# EAGLE design stm32wb55vgy6-breakout (EAGLE 9.6.2)
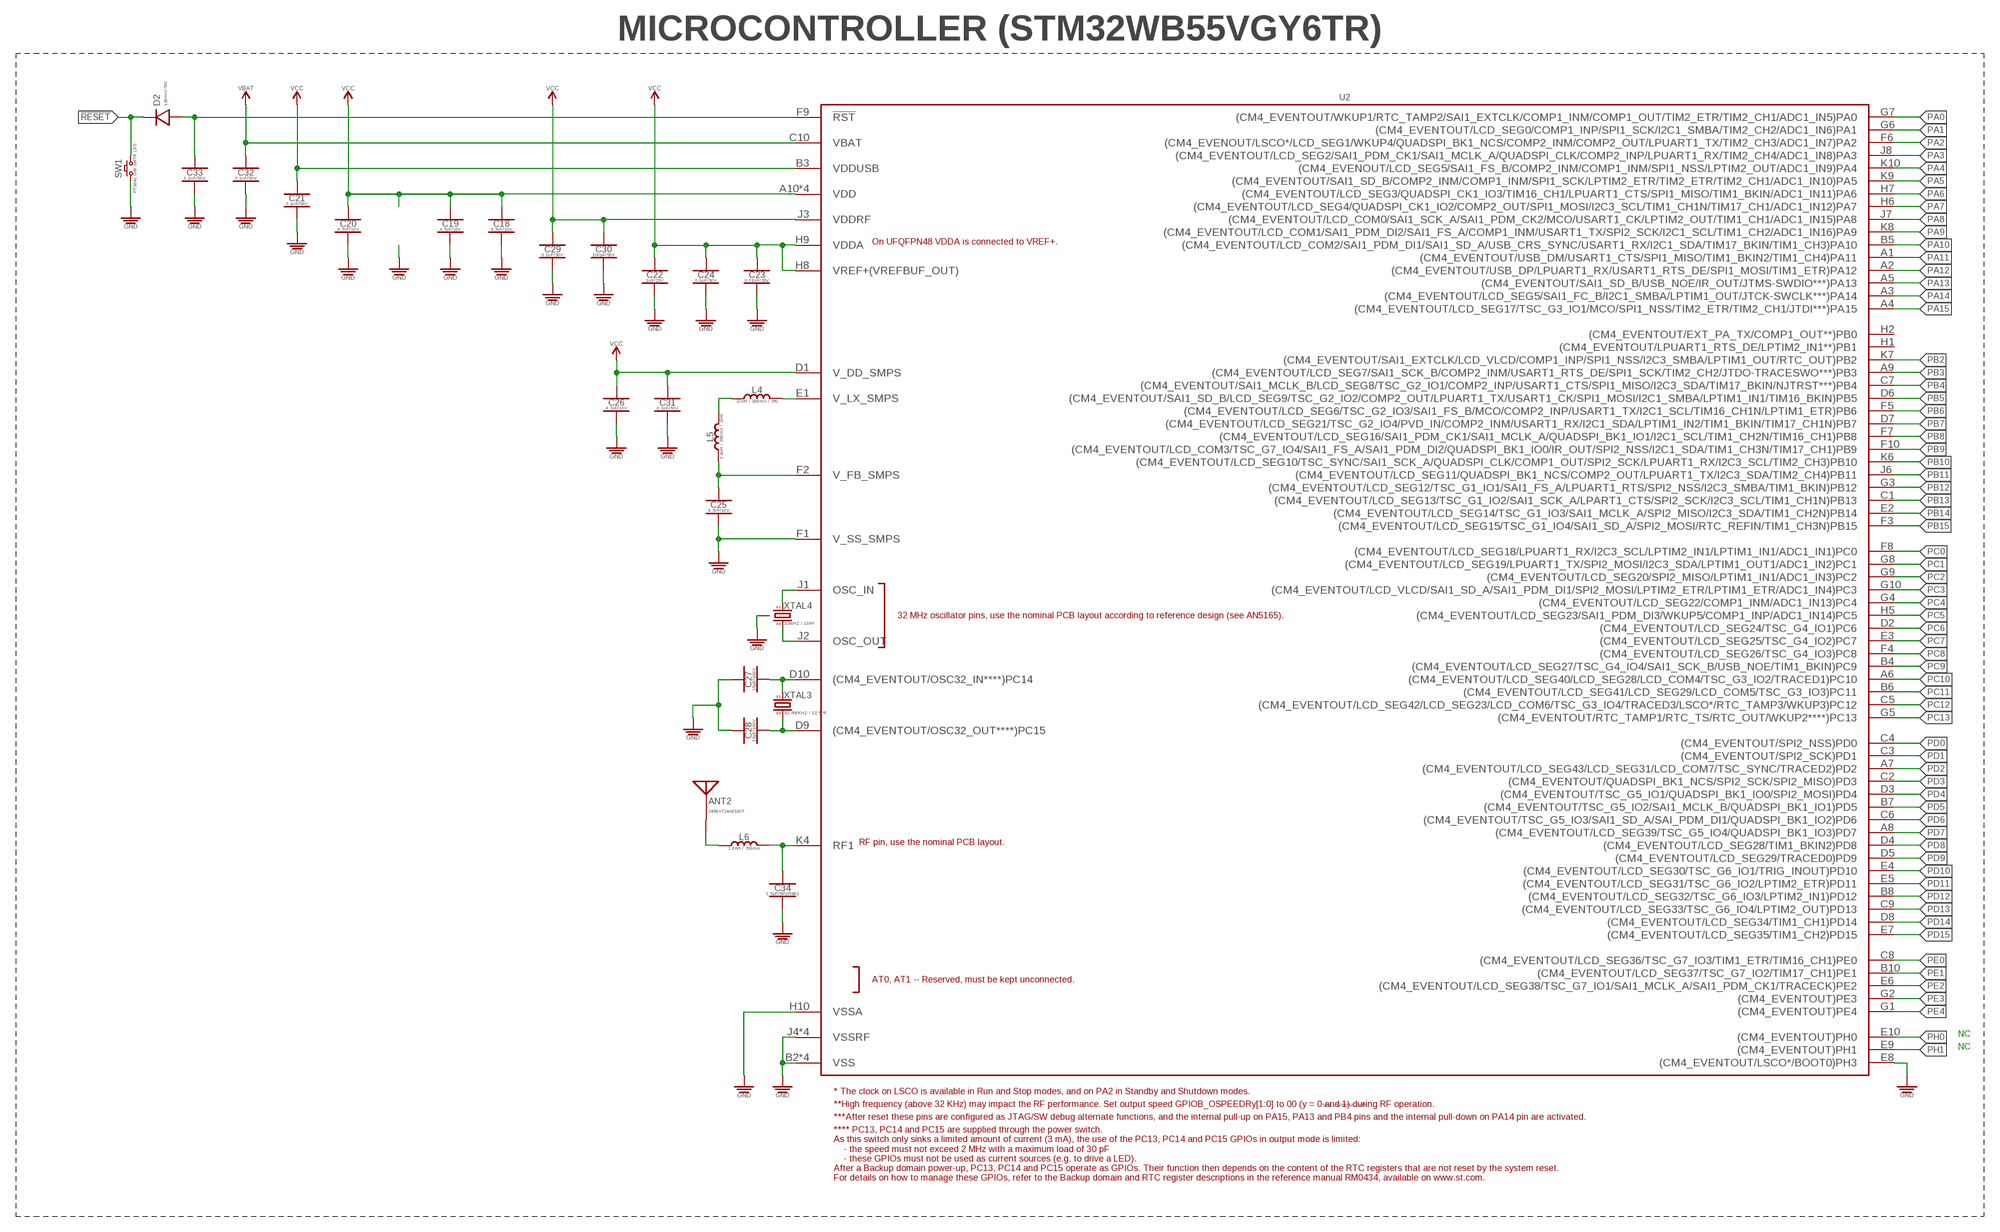
[diagram p0: schematic, sheet 1, part 1 of 2]
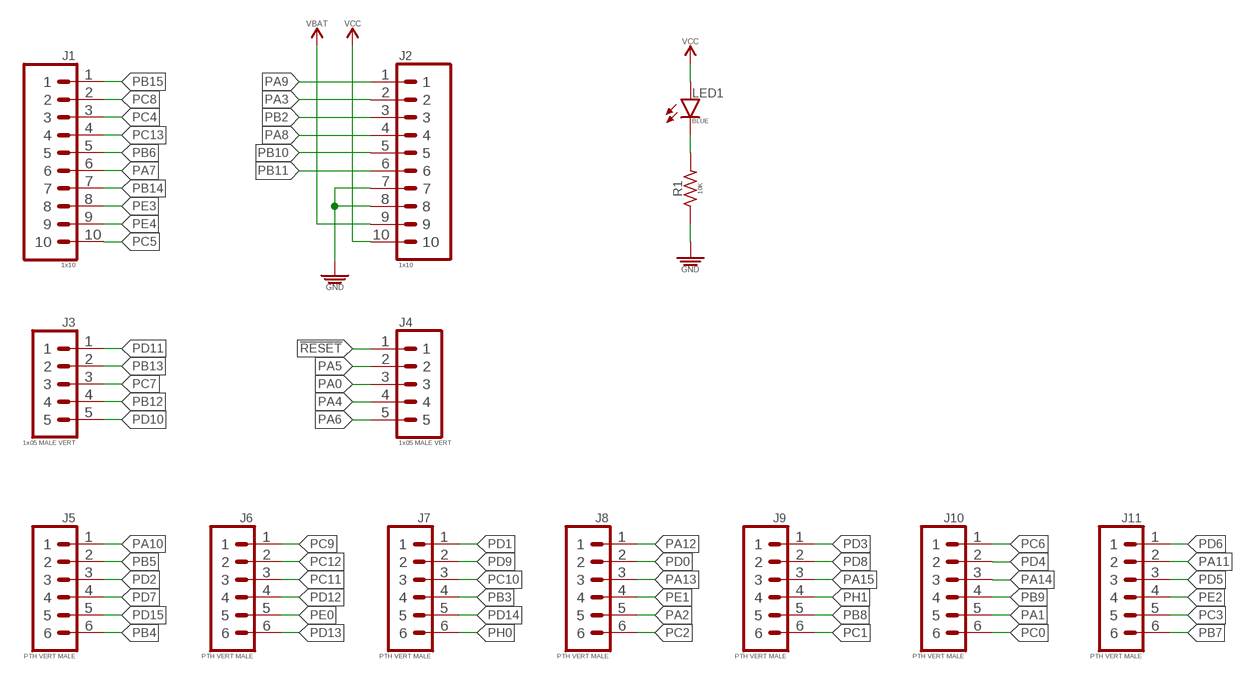
[diagram p1: schematic, sheet 1, part 2 of 2]

## Parts
ANT2  2450AT14A0100T  2.4GHZ-1PIN  [RESC1608X40N]
C18  4.7uF/10V  4.7UF_CER_SMD-0402_10V-20%  [CAPC1005X55_SMD-0402]
C19  4.7uF/10V  4.7UF_CER_SMD-0402_10V-20%  [CAPC1005X55_SMD-0402]
C20  4.7uF/10V  4.7UF_CER_SMD-0402_10V-20%  [CAPC1005X55_SMD-0402]
C21  0.1uF/50V  0.1UF_SMD-0402_50V-10%  [CAPC1005X55_SMD-0402]
C22  1uF/25V  1UF_CER_SMD-0402_25V-10%  [CAPC1005X55_SMD-0402]
C23  0.01uF/35V  0.01UF_CER_SMD-0402_35V-10%  [CAPC1005X55_SMD-0402]
C24  0.1uF/50V  0.1UF_SMD-0402_50V-10%  [CAPC1005X55_SMD-0402]
C25  4.7uF/10V  4.7UF_CER_SMD-0402_10V-20%  [CAPC1005X55_SMD-0402]
C26  4.7uF/10V  4.7UF_CER_SMD-0402_10V-20%  [CAPC1005X55_SMD-0402]
C27  15pF/100V  15PF_SMD-0402_100V-10%  [CAPC1005X55_SMD-0402]
C28  15pF/100V  15PF_SMD-0402_100V-10%  [CAPC1005X55_SMD-0402]
C29  0.1uF/50V  0.1UF_SMD-0402_50V-10%  [CAPC1005X55_SMD-0402]
C30  100pF/50V  100PF_SMD-0402_50V-10%  [CAPC1005X55_SMD-0402]
C31  0.1uF/50V  0.1UF_SMD-0402_50V-10%  [CAPC1005X55_SMD-0402]
C32  0.1uF/50V  0.1UF_SMD-0402_50V-10%  [CAPC1005X55_SMD-0402]
C33  0.1uF/50V  0.1UF_SMD-0402_50V-10%  [CAPC1005X55_SMD-0402]
C34  1.5pF/50V/0402  1.5PF_CER_SMD-0402-100V-5%  [CAPC1005X55_SMD-0402]
D2  150mA/75V  GENERAL-PURPOSE_SMD-0402_GP_150MA-75V  [DFN100X60X55-2]
J1  1x10  1X10_PTH_VERT-MALE_2.54MM  [HDRV10W64P254_1X10_2540X254X838B]
J2  1x10  1X10_PTH_VERT-MALE_2.54MM  [HDRV10W64P254_1X10_2540X254X838B]
J3  1x05 MALE VERT  1X05_PTH_VERT_MALE_2.54MM  [HDRV5W64P254_1X5_1270X254X838B]
J4  1x05 MALE VERT  1X05_PTH_VERT_MALE_2.54MM  [HDRV5W64P254_1X5_1270X254X838B]
J5  PTH VERT MALE  1X06_PTH_VERT_MALE_2.54MM  [HDRV6W64P254_1X6_1524X254X838B]
J6  PTH VERT MALE  1X06_PTH_VERT_MALE_2.54MM  [HDRV6W64P254_1X6_1524X254X838B]
J7  PTH VERT MALE  1X06_PTH_VERT_MALE_2.54MM  [HDRV6W64P254_1X6_1524X254X838B]
J8  PTH VERT MALE  1X06_PTH_VERT_MALE_2.54MM  [HDRV6W64P254_1X6_1524X254X838B]
J9  PTH VERT MALE  1X06_PTH_VERT_MALE_2.54MM  [HDRV6W64P254_1X6_1524X254X838B]
J10  PTH VERT MALE  1X06_PTH_VERT_MALE_2.54MM  [HDRV6W64P254_1X6_1524X254X838B]
J11  PTH VERT MALE  1X06_PTH_VERT_MALE_2.54MM  [HDRV6W64P254_1X6_1524X254X838B]
L4  10nH / 200mA / 2%  10NH_SMD-0402_200MA-1.35OHM-2%  [INDC1005X32N]
L5  2.2uH / 350mA / 20%  2.2UH_SMD-0402_350MA-0.550OHM-20%  [INDC1005X32N]
L6  1.8nH / 700mA  1.8NH_SMD-0402_200MA-1.35OHM-2%  [INDC1005X32N]
LED1  BLUE  LED_SMD-0402_DISCRETE_BLUE  [LEDC1005X40_LED-0402]
R1  10K  10KΩ_SMD-0402_1/16W-5%  [RESC1005X35_SMD-0402]
SW1  PTS841 GM SMTR LFS  SWITCH_MOMENTARY_PTS841GMSMTRLFS  [SW_MOMENTARY_SPST-NO_PTS841-GM-SMTR-LFS]
U2  STM32WB55VGY6TR  STM32WB55VXYX-STM32WB55VGY6  [BGA100N40P10X10_438X440X59N]
XTAL3  32.768KHZ / 12.5PF  CRYSTAL-2_NX2012SA_23K768_12.5PF  [OSCCC205X120X55N]
XTAL4  32MHZ / 10PF  CRYSTAL-4_ABM11_32MHZ_10PF  [OSCCC200X160X59N]

## Nets
!RESET!: D2.K J4.1 SW1.3 SW1.4
FEED: ANT2.FEED L6.1
GND: C18.2 C19.2 C20.2 C21.2 C22.2 C23.2 C24.2 C25.2 C26.2 C27.1 C28.1 C29.2 C30.2 C31.2 C32.2 C33.2 C34.2 J2.7 J2.8 R1.1 SW1.1 SW1.2 U2.B2(VSS) U2.B9(VSS) U2.E8((CM4_EVENTOUT/LSCO*/BOOT0)PH3) U2.F1(V_SS_SMPS) U2.H10(VSSA) U2.J4(VSSRF) U2.J5(VSS) U2.J9(VSS) U2.K1(VSSRF) U2.K2(VSSRF) U2.K3(VSSRF) XTAL4.2(GND) XTAL4.4(GND)
N$1: LED1.K R1.2
N$10: L4.1 L5.2
N$11: C25.1 L5.1 U2.F2(V_FB_SMPS)
N$12: U2.J1(OSC_IN) XTAL4.1(XTAL1)
N$13: U2.J2(OSC_OUT) XTAL4.3(XTAL2)
N$14: C27.2 U2.D10((CM4_EVENTOUT/OSC32_IN****)PC14) XTAL3.X1
N$15: C28.2 U2.D9((CM4_EVENTOUT/OSC32_OUT****)PC15) XTAL3.X2
N$16: L4.2 U2.E1(V_LX_SMPS)
N$18: C33.1 D2.A U2.F9(!RST!)
PA0: J4.3 U2.G7((CM4_EVENTOUT/WKUP1/RTC_TAMP2/SAI1_EXTCLK/COMP1_INM/COMP1_OUT/TIM2_ETR/TIM2_CH1/ADC1_IN5)PA0)
PA1: J10.5 U2.G6((CM4_EVENTOUT/LCD_SEG0/COMP1_INP/SPI1_SCK/I2C1_SMBA/TIM2_CH2/ADC1_IN6)PA1)
PA2: J8.5 U2.F6((CM4_EVENOUT/LSCO*/LCD_SEG1/WKUP4/QUADSPI_BK1_NCS/COMP2_INM/COMP2_OUT/LPUART1_TX/TIM2_CH3/ADC1_IN7)PA2)
PA3: J2.2 U2.J8((CM4_EVENTOUT/LCD_SEG2/SAI1_PDM_CK1/SAI1_MCLK_A/QUADSPI_CLK/COMP2_INP/LPUART1_RX/TIM2_CH4/ADC1_IN8)PA3)
PA4: J4.4 U2.K10((CM4_EVENOUT/LCD_SEG5/SAI1_FS_B/COMP2_INM/COMP1_INM/SPI1_NSS/LPTIM2_OUT/ADC1_IN9)PA4)
PA5: J4.2 U2.K9((CM4_EVENTOUT/SAI1_SD_B/COMP2_INM/COMP1_INM/SPI1_SCK/LPTIM2_ETR/TIM2_ETR/TIM2_CH1/ADC1_IN10)PA5)
PA6: J4.5 U2.H7((CM4_EVENTOUT/LCD_SEG3/QUADSPI_CK1_IO3/TIM16_CH1/LPUART1_CTS/SPI1_MISO/TIM1_BKIN/ADC1_IN11)PA6)
PA7: J1.6 U2.H6((CM4_EVENTOUT/LCD_SEG4/QUADSPI_CK1_IO2/COMP2_OUT/SPI1_MOSI/I2C3_SCL/TIM1_CH1N/TIM17_CH1/ADC1_IN12)PA7)
PA8: J2.4 U2.J7((CM4_EVENTOUT/LCD_COM0/SAI1_SCK_A/SAI1_PDM_CK2/MCO/USART1_CK/LPTIM2_OUT/TIM1_CH1/ADC1_IN15)PA8)
PA9: J2.1 U2.K8((CM4_EVENTOUT/LCD_COM1/SAI1_PDM_DI2/SAI1_FS_A/COMP1_INM/USART1_TX/SPI2_SCK/I2C1_SCL/TIM1_CH2/ADC1_IN16)PA9)
PA10: J5.1 U2.B5((CM4_EVENTOUT/LCD_COM2/SAI1_PDM_DI1/SAI1_SD_A/USB_CRS_SYNC/USART1_RX/I2C1_SDA/TIM17_BKIN/TIM1_CH3)PA10)
PA11: J11.2 U2.A1((CM4_EVENTOUT/USB_DM/USART1_CTS/SPI1_MISO/TIM1_BKIN2/TIM1_CH4)PA11)
PA12: J8.1 U2.A2((CM4_EVENTOUT/USB_DP/LPUART1_RX/USART1_RTS_DE/SPI1_MOSI/TIM1_ETR)PA12)
PA13: J8.3 U2.A5((CM4_EVENTOUT/SAI1_SD_B/USB_NOE/IR_OUT/JTMS-SWDIO***)PA13)
PA14: J10.3 U2.A3((CM4_EVENTOUT/LCD_SEG5/SAI1_FC_B/I2C1_SMBA/LPTIM1_OUT/JTCK-SWCLK***)PA14)
PA15: J9.3 U2.A4((CM4_EVENTOUT/LCD_SEG17/TSC_G3_IO1/MCO/SPI1_NSS/TIM2_ETR/TIM2_CH1/JTDI***)PA15)
PB2: J2.3 U2.K7((CM4_EVENTOUT/SAI1_EXTCLK/LCD_VLCD/COMP1_INP/SPI1_NSS/I2C3_SMBA/LPTIM1_OUT/RTC_OUT)PB2)
PB3: J7.4 U2.A9((CM4_EVENTOUT/LCD_SEG7/SAI1_SCK_B/COMP2_INM/USART1_RTS_DE/SPI1_SCK/TIM2_CH2/JTDO-TRACESWO***)PB3)
PB4: J5.6 U2.C7((CM4_EVENTOUT/SAI1_MCLK_B/LCD_SEG8/TSC_G2_IO1/COMP2_INP/USART1_CTS/SPI1_MISO/I2C3_SDA/TIM17_BKIN/NJTRST***)PB4)
PB5: J5.2 U2.D6((CM4_EVENTOUT/SAI1_SD_B/LCD_SEG9/TSC_G2_IO2/COMP2_OUT/LPUART1_TX/USART1_CK/SPI1_MOSI/I2C1_SMBA/LPTIM1_IN1/TIM16_BKIN)PB5)
PB6: J1.5 U2.F5((CM4_EVENTOUT/LCD_SEG6/TSC_G2_IO3/SAI1_FS_B/MCO/COMP2_INP/USART1_TX/I2C1_SCL/TIM16_CH1N/LPTIM1_ETR)PB6)
PB7: J11.6 U2.D7((CM4_EVENTOUT/LCD_SEG21/TSC_G2_IO4/PVD_IN/COMP2_INM/USART1_RX/I2C1_SDA/LPTIM1_IN2/TIM1_BKIN/TIM17_CH1N)PB7)
PB8: J9.5 U2.F7((CM4_EVENTOUT/LCD_SEG16/SAI1_PDM_CK1/SAI1_MCLK_A/QUADSPI_BK1_IO1/I2C1_SCL/TIM1_CH2N/TIM16_CH1)PB8)
PB9: J10.4 U2.F10((CM4_EVENTOUT/LCD_COM3/TSC_G7_IO4/SAI1_FS_A/SAI1_PDM_DI2/QUADSPI_BK1_IO0/IR_OUT/SPI2_NSS/I2C1_SDA/TIM1_CH3N/TIM17_CH1)PB9)
PB10: J2.5 U2.K6((CM4_EVENTOUT/LCD_SEG10/TSC_SYNC/SAI1_SCK_A/QUADSPI_CLK/COMP1_OUT/SPI2_SCK/LPUART1_RX/I2C3_SCL/TIM2_CH3)PB10)
PB11: J2.6 U2.J6((CM4_EVENTOUT/LCD_SEG11/QUADSPI_BK1_NCS/COMP2_OUT/LPUART1_TX/I2C3_SDA/TIM2_CH4)PB11)
PB12: J3.4 U2.G3((CM4_EVENTOUT/LCD_SEG12/TSC_G1_IO1/SAI1_FS_A/LPUART1_RTS/SPI2_NSS/I2C3_SMBA/TIM1_BKIN)PB12)
PB13: J3.2 U2.C1((CM4_EVENTOUT/LCD_SEG13/TSC_G1_IO2/SAI1_SCK_A/LPART1_CTS/SPI2_SCK/I2C3_SCL/TIM1_CH1N)PB13)
PB14: J1.7 U2.E2((CM4_EVENTOUT/LCD_SEG14/TSC_G1_IO3/SAI1_MCLK_A/SPI2_MISO/I2C3_SDA/TIM1_CH2N)PB14)
PB15: J1.1 U2.F3((CM4_EVENTOUT/LCD_SEG15/TSC_G1_IO4/SAI1_SD_A/SPI2_MOSI/RTC_REFIN/TIM1_CH3N)PB15)
PC0: J10.6 U2.F8((CM4_EVENTOUT/LCD_SEG18/LPUART1_RX/I2C3_SCL/LPTIM2_IN1/LPTIM1_IN1/ADC1_IN1)PC0)
PC1: J9.6 U2.G8((CM4_EVENTOUT/LCD_SEG19/LPUART1_TX/SPI2_MOSI/I2C3_SDA/LPTIM1_OUT1/ADC1_IN2)PC1)
PC2: J8.6 U2.G9((CM4_EVENTOUT/LCD_SEG20/SPI2_MISO/LPTIM1_IN1/ADC1_IN3)PC2)
PC3: J11.5 U2.G10((CM4_EVENTOUT/LCD_VLCD/SAI1_SD_A/SAI1_PDM_DI1/SPI2_MOSI/LPTIM2_ETR/LPTIM1_ETR/ADC1_IN4)PC3)
PC4: J1.3 U2.G4((CM4_EVENTOUT/LCD_SEG22/COMP1_INM/ADC1_IN13)PC4)
PC5: J1.10 U2.H5((CM4_EVENTOUT/LCD_SEG23/SAI1_PDM_DI3/WKUP5/COMP1_INP/ADC1_IN14)PC5)
PC6: J10.1 U2.D2((CM4_EVENTOUT/LCD_SEG24/TSC_G4_IO1)PC6)
PC7: J3.3 U2.E3((CM4_EVENTOUT/LCD_SEG25/TSC_G4_IO2)PC7)
PC8: J1.2 U2.F4((CM4_EVENTOUT/LCD_SEG26/TSC_G4_IO3)PC8)
PC9: J6.1 U2.B4((CM4_EVENTOUT/LCD_SEG27/TSC_G4_IO4/SAI1_SCK_B/USB_NOE/TIM1_BKIN)PC9)
PC10: J7.3 U2.A6((CM4_EVENTOUT/LCD_SEG40/LCD_SEG28/LCD_COM4/TSC_G3_IO2/TRACED1)PC10)
PC11: J6.3 U2.B6((CM4_EVENTOUT/LCD_SEG41/LCD_SEG29/LCD_COM5/TSC_G3_IO3)PC11)
PC12: J6.2 U2.C5((CM4_EVENTOUT/LCD_SEG42/LCD_SEG23/LCD_COM6/TSC_G3_IO4/TRACED3/LSCO*/RTC_TAMP3/WKUP3)PC12)
PC13: J1.4 U2.G5((CM4_EVENTOUT/RTC_TAMP1/RTC_TS/RTC_OUT/WKUP2****)PC13)
PD0: J8.2 U2.C4((CM4_EVENTOUT/SPI2_NSS)PD0)
PD1: J7.1 U2.C3((CM4_EVENTOUT/SPI2_SCK)PD1)
PD2: J5.3 U2.A7((CM4_EVENTOUT/LCD_SEG43/LCD_SEG31/LCD_COM7/TSC_SYNC/TRACED2)PD2)
PD3: J9.1 U2.C2((CM4_EVENTOUT/QUADSPI_BK1_NCS/SPI2_SCK/SPI2_MISO)PD3)
PD4: J10.2 U2.D3((CM4_EVENTOUT/TSC_G5_IO1/QUADSPI_BK1_IO0/SPI2_MOSI)PD4)
PD5: J11.3 U2.B7((CM4_EVENTOUT/TSC_G5_IO2/SAI1_MCLK_B/QUADSPI_BK1_IO1)PD5)
PD6: J11.1 U2.C6((CM4_EVENTOUT/TSC_G5_IO3/SAI1_SD_A/SAI_PDM_DI1/QUADSPI_BK1_IO2)PD6)
PD7: J5.4 U2.A8((CM4_EVENTOUT/LCD_SEG39/TSC_G5_IO4/QUADSPI_BK1_IO3)PD7)
PD8: J9.2 U2.D4((CM4_EVENTOUT/LCD_SEG28/TIM1_BKIN2)PD8)
PD9: J7.2 U2.D5((CM4_EVENTOUT/LCD_SEG29/TRACED0)PD9)
PD10: J3.5 U2.E4((CM4_EVENTOUT/LCD_SEG30/TSC_G6_IO1/TRIG_INOUT)PD10)
PD11: J3.1 U2.E5((CM4_EVENTOUT/LCD_SEG31/TSC_G6_IO2/LPTIM2_ETR)PD11)
PD12: J6.4 U2.B8((CM4_EVENTOUT/LCD_SEG32/TSC_G6_IO3/LPTIM2_IN1)PD12)
PD13: J6.6 U2.C9((CM4_EVENTOUT/LCD_SEG33/TSC_G6_IO4/LPTIM2_OUT)PD13)
PD14: J7.5 U2.D8((CM4_EVENTOUT/LCD_SEG34/TIM1_CH1)PD14)
PD15: J5.5 U2.E7((CM4_EVENTOUT/LCD_SEG35/TIM1_CH2)PD15)
PE0: J6.5 U2.C8((CM4_EVENTOUT/LCD_SEG36/TSC_G7_IO3/TIM1_ETR/TIM16_CH1)PE0)
PE1: J8.4 U2.B10((CM4_EVENTOUT/LCD_SEG37/TSC_G7_IO2/TIM17_CH1)PE1)
PE2: J11.4 U2.E6((CM4_EVENTOUT/LCD_SEG38/TSC_G7_IO1/SAI1_MCLK_A/SAI1_PDM_CK1/TRACECK)PE2)
PE3: J1.8 U2.G2((CM4_EVENTOUT)PE3)
PE4: J1.9 U2.G1((CM4_EVENTOUT)PE4)
PH0: J7.6 U2.E10((CM4_EVENTOUT)PH0)
PH1: J9.4 U2.E9((CM4_EVENTOUT)PH1)
RF: C34.1 L6.2 U2.K4(RF1)
VBAT: C32.1 J2.9 U2.C10(VBAT)
VCC: C18.1 C19.1 C20.1 C21.1 C22.1 C23.1 C24.1 C26.1 C29.1 C30.1 C31.1 J2.10 LED1.A U2.A10(VDD) U2.B1(VDD) U2.B3(VDDUSB) U2.D1(V_DD_SMPS) U2.H8(VREF+(VREFBUF_OUT)) U2.H9(VDDA) U2.J3(VDDRF) U2.J10(VDD) U2.K5(VDD)
Unconnected: U2.H1((CM4_EVENTOUT/LPUART1_RTS_DE/LPTIM2_IN1**)PB1) U2.H2((CM4_EVENTOUT/EXT_PA_TX/COMP1_OUT**)PB0)

## Notes on the sheet
- MICROCONTROLLER (STM32WB55VGY6TR)
- NC
- NC

## Library data of the parts
ANT2 = _antenna:2.4GHZ-1PIN; DATASHEET: https://www.johansontechnology.com/datasheets/2450AT14A0100/2450AT14A0100.pdf; DIST: Digikey; DISTLINK: https://www.digikey.com/en/products/detail/johanson-technology-inc/2450AT14A0100T/7943534?s=N4IgTCBcDaIOwEYwFoEDYDMbXIHIBEQBdAXyA; DISTPN: 712-1636-1-ND; MFR: Johanson Technology Inc.; MPN: 2450AT14A0100T
C18-C20 C25 C26 = _capacitors:4.7UF; DATASHEET: http://www.samsungsem.com/kr/support/product-search/mlcc/CL05A475MP5NRNC.jsp; DIST: Digikey; DISTLINK: https://www.digikey.com/products/en?keywords=1276-1482-1-ND; DISTPN: 1276-1482-1-ND; MFR: Samsung Electro-Mechanics; MPN: CL05A475MP5NRNC
C21 C24 C29 C31-C33 = _capacitors:0.1UF; DATASHEET: https://product.tdk.com/info/en/catalog/datasheets/mlcc_commercial_soft_en.pdf; DIST: Digikey; DISTLINK: https://www.digikey.com/products/en?keywords=445-173610-1-ND; DISTPN: 445-173610-1-ND; MFR: TDK Corporation; MPN: C1005X7R1H104K050BE
C22 = _capacitors:1UF; DATASHEET: https://product.tdk.com/info/en/catalog/datasheets/mlcc_commercial_lowprofile_en.pdf; DIST: Digikey; DISTLINK: https://www.digikey.com/products/en?keywords=445-13185-1-ND; DISTPN: 445-13185-1-ND; MFR: TDK Corporation; MPN: CGB2A1X5R1E105K033BC
C23 = _capacitors:0.01UF; DATASHEET: https://product.tdk.com/info/en/documents/chara_sheet/CGA2B3X5R1V103K050BB.pdf; DIST: Digikey; DISTLINK: https://www.digikey.com/products/en?keywords=445-12187-1-ND; DISTPN: 445-12187-1-ND; MFR: TDK Corporation; MPN: CGA2B3X5R1V103K050BB
C27 C28 = _capacitors:15PF; DATASHEET: https://ds.yuden.co.jp/TYCOMPAS/ut/detail?pn=HMK105CG150JV-F%20&u=M; DIST: Digikey; DISTLINK: https://www.digikey.com/en/products/detail/taiyo-yuden/HMK105CG150JV-F/6563595?s=N4IgTCBcDaIKwA4DsBaOAGdYUEYUDkAREAXQF8g; DISTPN: 587-5002-1-ND; MFR: Taiyo Yuden; MPN: HMK105CG150JV-F
C30 = _capacitors:100PF; DATASHEET: http://datasheets.avx.com/X7RDielectric.pdf; DIST: Digikey; DISTLINK: https://www.digikey.com/en/products/detail/avx-corporation/04025C101KAT2A/563199?s=N4IgTCBcDaICwHYAcBaAjABiQTnSgcgCIgC6AvkA; DISTPN: 478-1089-1-ND; MFR: AVX Corporation; MPN: 04025C101KAT2A
C34 = _capacitors:1.5PF; DATASHEET: https://www.yuden.co.jp/productdata/catalog/mlcc04_e.pdf; DIST: Digikey; DISTLINK: https://www.digikey.com/en/products/detail/taiyo-yuden/UVK105CH1R5BW-F/930363?s=N4IgTCBcDaIKwA4DsBaAjABjW9KByAIiALoC%2BQA; DISTPN: 587-1011-1-ND; MFR: Taiyo Yuden; MPN: UVK105CH1R5BW-F
D2 = _discrete_semiconductors:GENERAL-PURPOSE; DATASHEET: http://www.comchiptech.com/cms/UserFiles/CDSQR4148-HF-RevC213424.pdf; DIST: Digikey; DISTLINK: https://www.digikey.com/products/en?keywords=641-1677-1-ND; DISTPN: 641-1677-1-ND; MFR: Comchip Technology; MPN: CDSQR4148-HF
J1 J2 = _connectors:1X10; DATASHEET: https://s3.amazonaws.com/catalogspreads-pdf/PAGE112-113%20.100%20MALE%20HDR.pdf; DIST: Digikey; DISTLINK: https://www.digikey.com/en/products/detail/sullins-connector-solutions/PEC10SAAN/859163?s=N4IgTCBcDaIMoEYAMCwFEC0yMDkAiIAugL5A; DISTPN: S1012E-10-ND; MFR: Sullins Connector Solutions; MPN: PEC10SAAN
J3 J4 = _connectors:1X05; DATASHEET: https://s3.amazonaws.com/catalogspreads-pdf/PAGE112-113%20.100%20MALE%20HDR.pdf; DIST: Digikey; DISTLINK: https://www.digikey.com/en/products/detail/sullins-connector-solutions/PEC05SAAN/859158?s=N4IgTCBcDaIMoEYAMCwFEC0SCsGByAIiALoC%2BQA; DISTPN: S1012E-05-ND; MFR: Sullins Connector Solutions; MPN: PEC05SAAN
J5-J11 = _connectors:1X06; DATASHEET: https://drawings-pdf.s3.amazonaws.com/C10436.pdf; DIST: Digikey; DISTLINK: https://www.digikey.com/products/en?keywords=PEC06SAAN; DISTPN: S1012E-06-ND; MFR: Sullins Connector Solutions; MPN: PEC06SAAN
L4 = _inductors:10NH: Choke Power Inductors; DATASHEET: https://www.te.com/commerce/DocumentDelivery/DDEController?Action=srchrtrv&DocNm=1773162&DocType=DS&DocLang=English; DIST: Digikey; DISTLINK: https://www.digikey.com/en/products/detail/te-connectivity-passive-product/36401E10NGTDF/5399583?s=N4IgTCBcDaIIIEYwE4AsA2VBhAKgWgDkAREAXQF8g; DISTPN: A129464CT-ND; MFR: TE Connectivity Passive Product; MPN: 36401E10NGTDF
L5 = _inductors:2.2UH: Choke Power Inductors; DATASHEET: https://product.tdk.com/info/en/catalog/datasheets/inductor_commercial_decoupling_mlz1005_en.pdf?ref_disty=digikey; DIST: Digikey; DISTLINK: https://www.digikey.com/en/products/detail/tdk-corporation/MLZ1005M2R2WT000/2465140?s=N4IgTCBcDaICxwKwFoBsBmAHARmbgcgCIgC6AvkA; DISTPN: 445-6381-1-ND; MFR: TDK Corporation; MPN: MLZ1005M2R2WT000
L6 = _inductors:1.8NH: Choke Power Inductors; DATASHEET: https://ds.yuden.co.jp/TYCOMPAS/ut/detail?pn=HK10051N8S-T%20%20&u=M; DIST: Digikey; DISTLINK: https://www.digikey.com/en/products/detail/taiyo-yuden/HK10051N8S-T/957886?s=N4IgTCBcDaIKwA4DsBaAjHADG9KByAIiALoC%2BQA; DISTPN: 587-1501-1-ND; MFR: Taiyo Yuden; MPN: HK10051N8S-T
LED1 = _leds:LED; DATASHEET: https://www.bivar.com/portals/0/products/SM0402BWC.pdf; DIST: Digikey; DISTLINK: https://www.digikey.com/products/en?keywords=492-2203-1-ND; DISTPN: 492-2203-1-ND; MFR: Bivar Inc.; MPN: SM0402BWC
R1 = _resistors:10KΩ; DATASHEET: http://www.yageo.com/NewPortal/yageodocoutput?fileName=/pdf/R-Chip/PYu-RC_51_RoHS_P_0.pdf; DIST: Digikey; DISTLINK: https://www.digikey.com/products/en?keywords=YAG1281CT-ND; DISTPN: YAG1281CT-ND; MFR: Yageo; MPN: RC0402JR-0710KP
SW1 = _switches:SWITCH_MOMENTARY; DATASHEET: https://www.ckswitches.com/media/2805/pts841.pdf; DIST: Digikey; DISTLINK: https://www.digikey.com/en/products/detail/c-k/PTS841-GM-SMTR-LFS/10445314?s=N4IgTCBcDaIIwAYAcBaACgFQMpICxwHEBZLIjAJQBkAxLAYQxQDkAREAXQF8g; DISTPN: 108-PTS841GMSMTRLFSCT-ND; MFR: C&K; MPN: PTS841 GM SMTR LFS
U2 = _ic_microcontrollers:STM32WB55VXYX: IC RF TxRx + MCU 802.15.4, Bluetooth Bluetooth v5.0 2.402GHz ~ 2.48GHz 100-UFBGA, WLCSP; DATASHEET: https://www.st.com/resource/en/datasheet/stm32wb55vg.pdf; DIST: Digikey; DISTLINK: https://www.digikey.com/en/products/detail/stmicroelectronics/STM32WB55VGY6TR/10821725?s=N4IgTCBcDaICwE4DsBaAygFQLIGYwHUAhAVmIDUBxATQDYBhDFAOQBEQBdAXyA; DISTPN: 497-STM32WB55VGY6CT-ND; MFR: STMicroelectronics; MPN: STM32WB55VGY6TR
XTAL3 = _crystals_oscillators_resonators:CRYSTAL-2: Various standard crystals. Proven footprints.; DATASHEET: https://www.digikey.com/htmldatasheets/production/1611839/0/0/1/nx2012sa-std-mub-1-series.html; DIST: Digikey; DISTLINK: https://www.digikey.com/en/products/detail/ndk-america-inc/NX2012SA-32-768K-STD-MUB-1/4914433?s=N4IgTCBcDaIGwBYEFoCMZUE43IHIBEQBdAXyA; DISTPN: 644-1219-1-ND; MFR: NDK America, Inc.; MPN: NX2012SA-32.768K-STD-MUB-1
XTAL4 = _crystals_oscillators_resonators:CRYSTAL-4: Various standard crystals. Proven footprints.; DATASHEET: https://abracon.com/Resonators/ABM11.pdf; DIST: Digikey; DISTLINK: https://www.digikey.com/en/products/detail/abracon-llc/ABM11-32-000MHZ-D2X-T3/2623746?s=N4IgTCBcDaIKwGY4FoCMAGAnAFgGxuQDkAREAXQF8g; DISTPN: 535-10946-1-ND; MFR: Abracon LLC; MPN: ABM11-32.000MHZ-D2X-T3

## Board
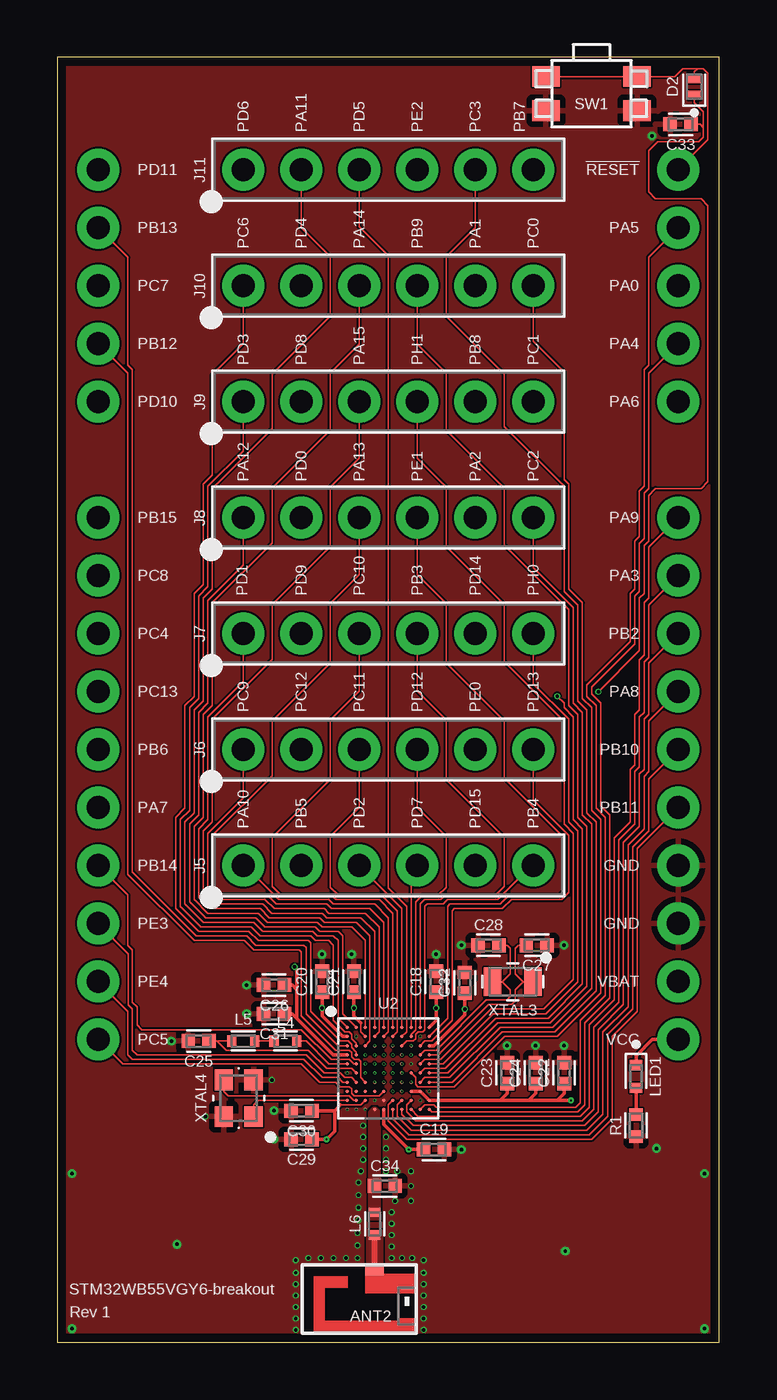
[diagram p2: board, top side]
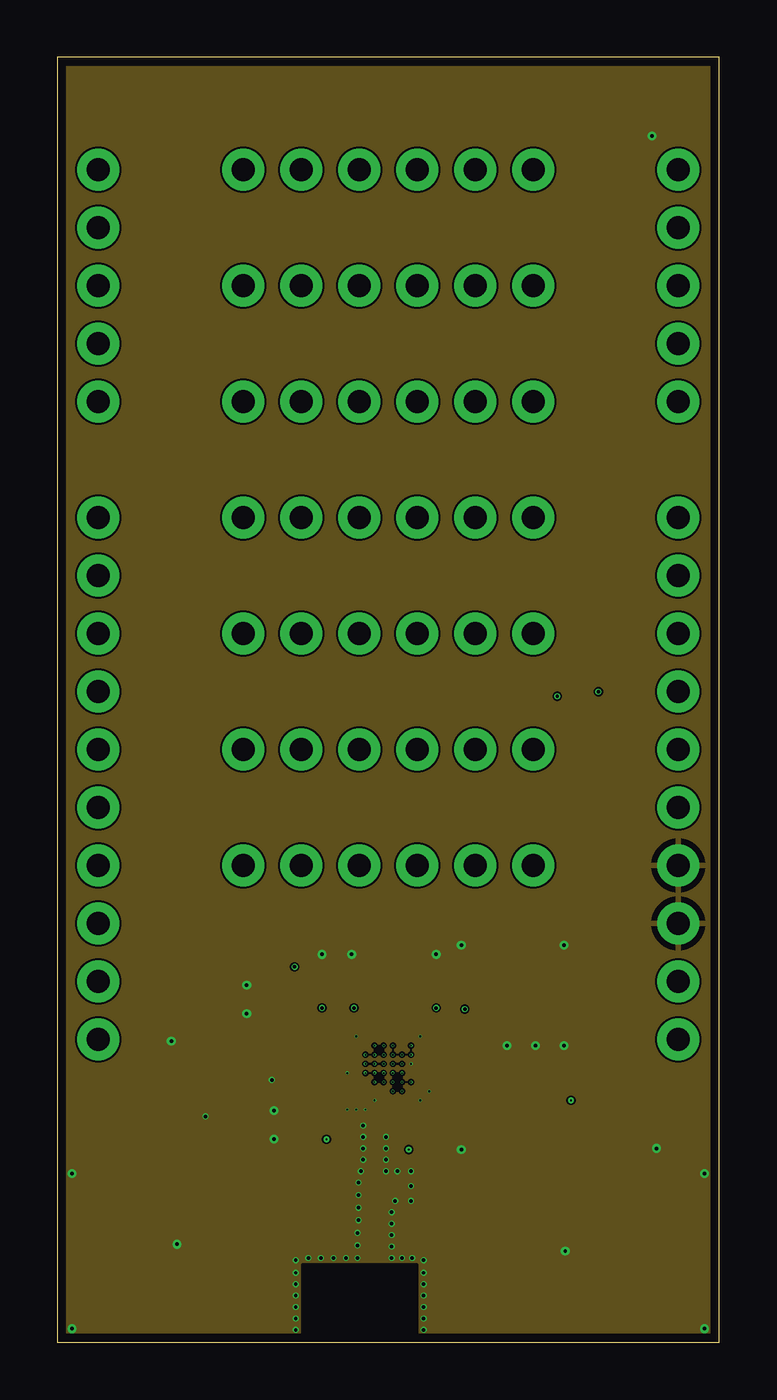
[diagram p3: board, inner layer Route2]
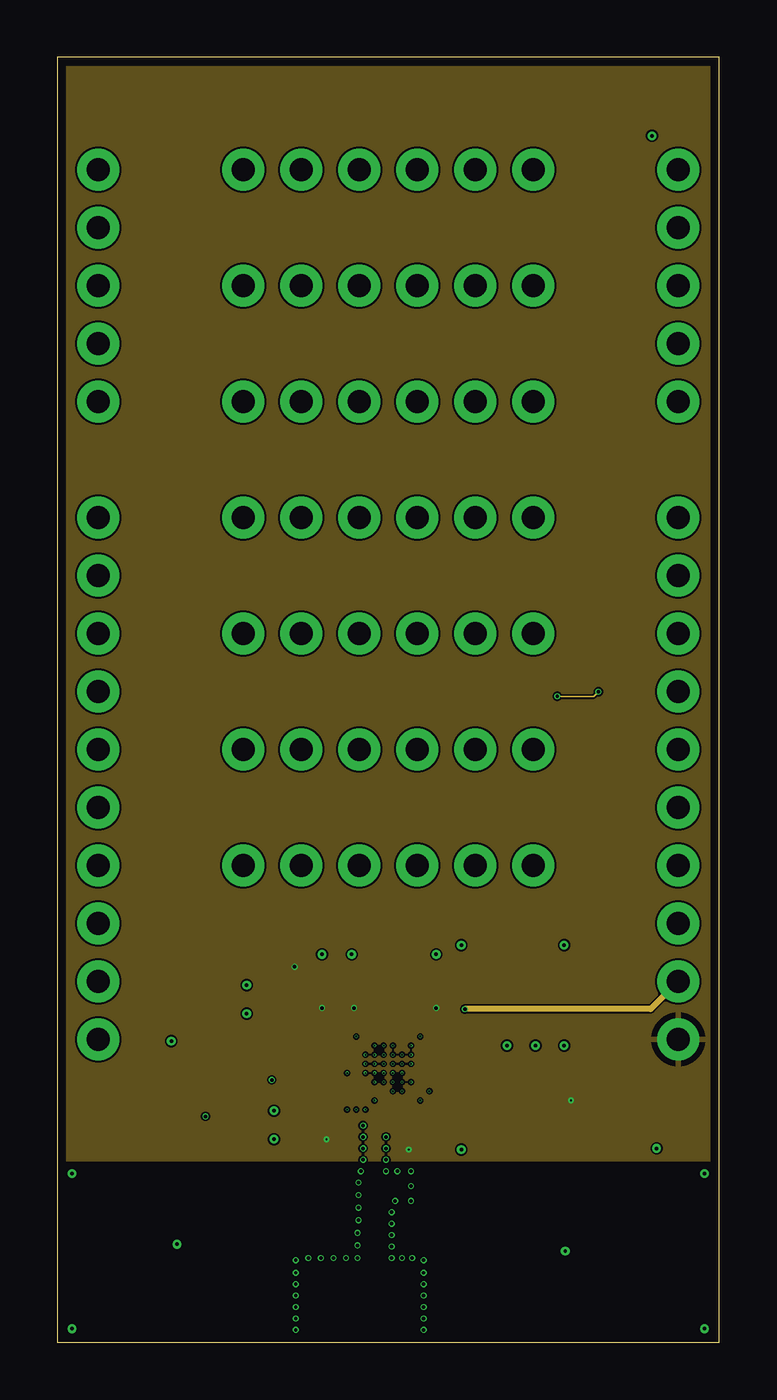
[diagram p4: board, inner layer Route15]
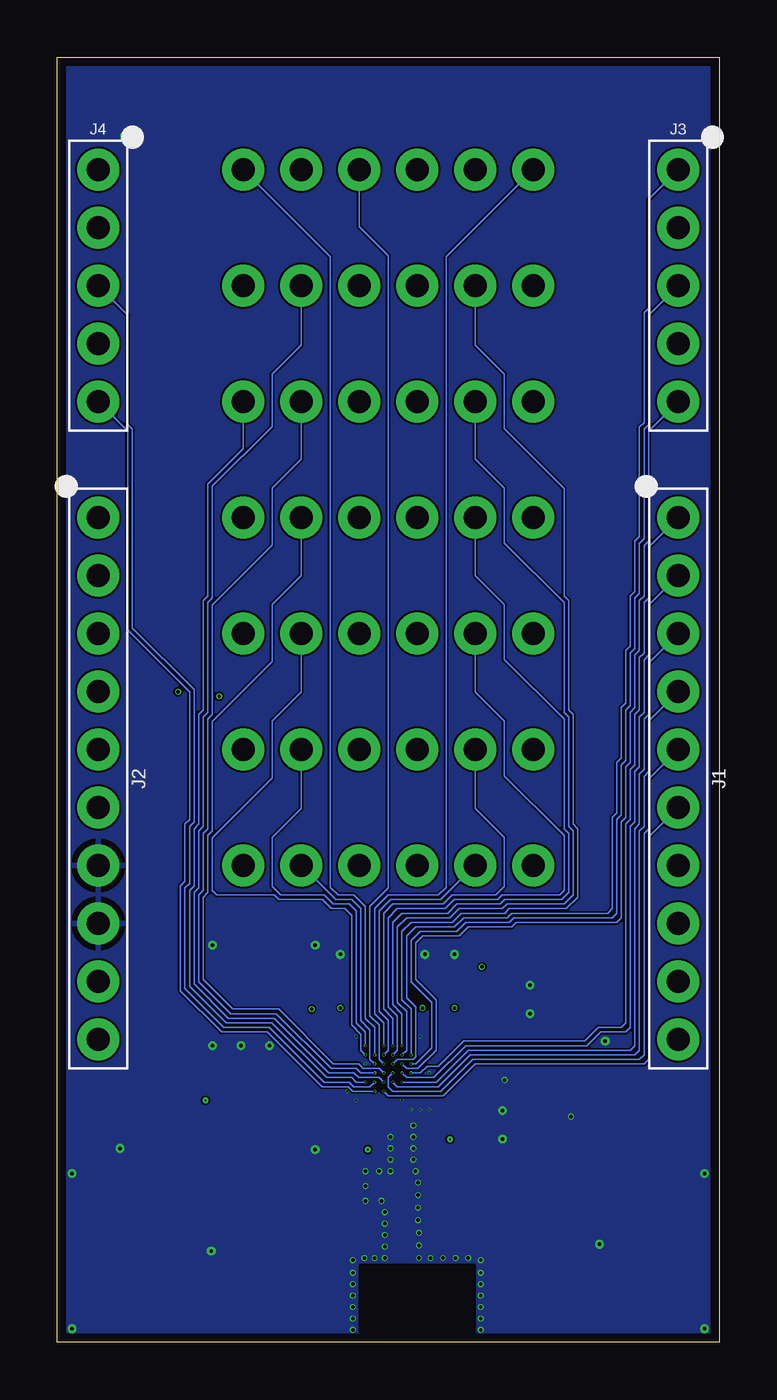
[diagram p5: board, bottom side, seen from below]

Size 29 x 56.3 mm. Coordinates in mm from the lower left corner, seen from the top.
Outline: 0,0 29,0 29,56.3 0,56.3 0,0
Copper layers (1*2*15*16): Top 0.035559375mm / dielectric 0.17018125mm / Route2 0.01778125mm / dielectric 47mil / Route15 0.01778125mm / dielectric 0.17018125mm / Bottom 0.035559375mm
Design rules "stella-wearables-4-layer-small-via": minimum track width 3mil, minimum drill 3mil, track to track 3mil, track to pad 2mil, pad to pad 3mil, via to via 3mil, smd to smd 3mil, copper to edge 15mil, drill to drill 6mil, minimum pad ring 5mil, minimum via ring 1mil, stop-mask expansion 2.5mil, vias tented up to drill 0mil, thermal gap 10mil

### Footprints (pad centres in the part's own frame; a part is rotated, then mirrored left to right if it is on the bottom)
RESC1608X40N = smd 0.8 x 0.45: FEED 1.83,0.225
CAPC1005X55_SMD-0402 = smd 0.585 x 0.612: 1 -0.458,0; 2 0.458,0
DFN100X60X55-2 = smd 0.41 x 0.55: A -0.37,0; K 0.37,0
HDRV10W64P254_1X10_2540X254X838B = drill 1 pad 1.85: 1 -11.43,0; 2 -8.89,0; 3 -6.35,0; 4 -3.81,0; 5 -1.27,0; 6 1.27,0; 7 3.81,0; 8 6.35,0; 9 8.89,0; 10 11.43,0
HDRV5W64P254_1X5_1270X254X838B = drill 1 pad 1.85: 1 -5.08,0; 2 -2.54,0; 3 0,0; 4 2.54,0; 5 5.08,0
HDRV6W64P254_1X6_1524X254X838B = drill 1 pad 1.85: 1 -6.35,0; 2 -3.81,0; 3 -1.27,0; 4 1.27,0; 5 3.81,0; 6 6.35,0
INDC1005X32N = smd 0.4 x 0.5: 1 -0.5,0; 2 0.5,0
LEDC1005X40_LED-0402 = smd 0.454 x 0.554: A -0.5,0; K 0.5,0
RESC1005X35_SMD-0402 = smd 0.535 x 0.6: 1 -0.482,0; 2 0.482,0
SW_MOMENTARY_SPST-NO_PTS841-GM-SMTR-LFS = smd 1.2 x 0.9: 1 -2,0.75; 2 2,0.75; 3 -2,-0.75; 4 2,-0.75
BGA100N40P10X10_438X440X59N = smd 0.15 x 0.15: A1 -1.8,1.8; A2 -1.4,1.8; A3 -1,1.8; A4 -0.6,1.8; A5 -0.2,1.8; A6 0.2,1.8; A7 0.6,1.8; A8 1,1.8; A9 1.4,1.8; A10 1.8,1.8; B1 -1.8,1.4; B2 -1.4,1.4; B3 -1,1.4; B4 -0.6,1.4; B5 -0.2,1.4; B6 0.2,1.4; B7 0.6,1.4; B8 1,1.4; B9 1.4,1.4; B10 1.8,1.4; C1 -1.8,1; C2 -1.4,1; C3 -1,1; C4 -0.6,1; C5 -0.2,1; C6 0.2,1; C7 0.6,1; C8 1,1; C9 1.4,1; C10 1.8,1; D1 -1.8,0.6; D2 -1.4,0.6; D3 -1,0.6; D4 -0.6,0.6; D5 -0.2,0.6; D6 0.2,0.6; D7 0.6,0.6; D8 1,0.6; D9 1.4,0.6; D10 1.8,0.6; E1 -1.8,0.2; E2 -1.4,0.2; E3 -1,0.2; E4 -0.6,0.2; E5 -0.2,0.2; E6 0.2,0.2; E7 0.6,0.2; E8 1,0.2; E9 1.4,0.2; E10 1.8,0.2; F1 -1.8,-0.2; F2 -1.4,-0.2; F3 -1,-0.2; F4 -0.6,-0.2; F5 -0.2,-0.2; F6 0.2,-0.2; F7 0.6,-0.2; F8 1,-0.2; F9 1.4,-0.2; F10 1.8,-0.2; G1 -1.8,-0.6; G2 -1.4,-0.6; G3 -1,-0.6; G4 -0.6,-0.6; G5 -0.2,-0.6; G6 0.2,-0.6; G7 0.6,-0.6; G8 1,-0.6; G9 1.4,-0.6; G10 1.8,-0.6; H1 -1.8,-1; H2 -1.4,-1; H3 -1,-1; H4 -0.6,-1; H5 -0.2,-1; H6 0.2,-1; H7 0.6,-1; H8 1,-1; H9 1.4,-1; H10 1.8,-1; J1 -1.8,-1.4; J2 -1.4,-1.4; J3 -1,-1.4; J4 -0.6,-1.4; J5 -0.2,-1.4; J6 0.2,-1.4; J7 0.6,-1.4; J8 1,-1.4; J9 1.4,-1.4; J10 1.8,-1.4; K1 -1.8,-1.8; K2 -1.4,-1.8; K3 -1,-1.8; K4 -0.6,-1.8; K5 -0.2,-1.8; K6 0.2,-1.8; K7 0.6,-1.8; K8 1,-1.8; K9 1.4,-1.8; K10 1.8,-1.8
OSCCC205X120X55N = smd 0.775 x 1.25: X1 -0.887,0; X2 0.887,0
OSCCC200X160X59N = smd 0.9 x 0.8: 1 -0.8,-0.65; 2 0.8,-0.65; 3 0.8,0.65; 4 -0.8,0.65

### Placement (x,y rotation side)
ANT2  15.73,3.4 180 top
C18  16.6,15.8 90 top
C19  16.5,8.45 0 top
C20  11.6,15.8 90 top
C21  13,15.8 90 top
C22  22.2,11.8 90 top
C23  19.7,11.8 90 top
C24  20.95,11.8 90 top
C25  6.2,13.2 180 top
C26  9.5,15.65 180 top
C27  21,17.4 180 top
C28  18.89,17.4 0 top
C29  10.7,8.9 180 top
C30  10.7,10.15 180 top
C31  9.5,14.4 180 top
C32  17.85,15.75 90 top
C33  27.3,53.35 180 top
C34  14.35,6.85 0 top
D2  27.9,55 90 top
J1  1.8,24.7 270 bottom
J2  27.2,24.7 270 bottom
J3  1.8,46.29 270 bottom
J4  27.2,46.29 270 bottom
J5  14.5,20.89 0 top
J6  14.5,25.97 0 top
J7  14.5,31.05 0 top
J8  14.5,36.13 0 top
J9  14.5,41.21 0 top
J10  14.5,46.29 0 top
J11  14.5,51.37 0 top
L4  10,13.2 0 top
L5  8.15,13.2 0 top
L6  13.9,5.2 90 top
LED1  25.35,11.65 270 top
R1  25.35,9.5 90 top
SW1  23.4,54.7 180 top
U2  14.5,12 0 top
XTAL3  19.95,15.8 180 top
XTAL4  7.95,10.7 90 top

### Tracks (layer width: path | path; a pad name or v marks a point on that pad's centre or on a via)
!RESET!
  Top 0.076: 28.05,55.8 27.4,55.8 27.05,55.45 SW1.3 SW1.4 | 28.05,55.8 28.3,55.8 28.5,55.6 28.5,52.67 J4.1 | D2.K 27.9,55.65 28.05,55.8
FEED
  Top 0.254: ANT2.FEED L6.1
  pour Top (no thermals): 13.55,3 14.25,3 14.25,4.9 13.55,4.9
GND  (via drill 0.08 pad 0.03, 0.08 pad 0.13, 0.15 pad 0.25, 0.15 pad 0.38)
  other vias: 15.9,13.4 13.1,13.4 16.3,11 15.9,10.6 13.9,10.6 13.5,10.2 13.1,10.2 12.7,10.2 12.7,11.8 8.3,14.4 5,13.2 9.5,10.15 9.5,8.9 8.3,15.65 11.6,17 12.9,17 16.6,17 19.7,13 20.95,13 22.2,13 17.7,8.45 22.2,17.4 17.7,17.4 15.5,12.2 13.4,9 13.4,8 13.4,8.5 14.4,8 14.4,8.5 15.5,7.5 10.45,0.55 10.45,1.05 10.45,1.55 10.45,2.05 10.45,2.55 10.45,3.05 10.45,3.6 11,3.7 11.55,3.7 12.1,3.7 12.65,3.7 13.15,3.7 13.3,7.5 15.55,3.7 13.4,9.5 14.65,3.7 14.65,4.2 14.65,4.7 13.15,4.25 13.15,4.8 13.2,5.35 13.2,5.9 13.2,6.45 14.65,5.2 14.65,5.7 14.8,6.2 15.5,6.2 15.5,6.85 14.9,7.5 14.4,7.5 13.2,7 15.1,3.7 14.4,9 26.05,52.85 9.4,11.5 6.5,9.9 16.05,0.55 16.05,1.05 16.05,1.55 16.05,2.05 16.05,2.55 16.05,3.05 16.05,3.6 26.25,8.5 28.35,7.4 28.35,0.6 22.25,4 5.25,4.3 0.65,7.4 0.65,0.6
  pour Bottom (rank 6): 0,0 29,0 29,56.3 0,56.3
  pour Route2 (rank 6): 0,0 29,0 29,56.3 0,56.3
  pour Top (rank 6): 0,0 29,0 29,56.3 0,56.3
  cutout Route2: 10.75,3.4 10.75,0 15.75,0 15.75,3.4
N$1
  Top 0.152: R1.2 LED1.K
N$10
  Top 0.076: L4.1 L5.2
N$11
  Top 0.076: U2.F2 12.9,12 11.8,12 11,12.8 7.4,12.8 7,13.2 | C25.1 7,13.2 | 7,13.2 L5.1
N$12
  Top 0.076: U2.J1 8.8,10.6 8.6,10.4 XTAL4.1
N$13
  Top 0.076: XTAL4.3 7.3,11 7.5,10.8 12.8,10.8 13,10.6 U2.J2
N$14
  Top 0.076: XTAL3.X1 20.4,15.8 | 20.4,15.8 20.05,15.45 20.05,14.95 19.9,14.8 18.9,14.8 16.7,12.6 U2.D10 | 20.4,15.8 20.05,16.15 20.05,17.25 20.2,17.4 C27.2
N$15
  Top 0.076: U2.D9 16.1,12.8 16.6,12.8 18.8,15 19.7,15 19.85,15.15 19.85,15.45 19.5,15.8 | XTAL3.X2 19.5,15.8 | 19.5,15.8 19.85,16.15 19.85,17.25 19.7,17.4 C28.2
N$16
  Top 0.076: U2.E1 11.9,12.2 10.9,13.2 L4.2
N$18  (via drill 0.15 pad 0.25)
  Top 0.076: U2.F9 16.1,12 17,12 19.2,14.2 21.5,14.2 23,15.7 23,22.5 22.6,22.9 22.6,27.4 22.2,27.8 22.2,28 v21.9,28.3 | v23.7,28.5 25.5,30.3 25.5,32.6 25.7,32.8 25.7,34.9 25.9,35.1 25.9,37.1 26.2,37.4 28.2,37.4 28.5,37.7 28.5,49.8 28.2,50.1 26.2,50.1 25.9,50.4 25.9,52.2 26.3,52.6 28.1,52.6 28.3,52.8 28.3,53.2 | D2.A 27.9,54.3 28.3,53.9 28.3,53.2 | C33.1 28.15,53.35 28.3,53.2
  Route15 0.076: v21.9,28.3 23.5,28.3 v23.7,28.5
PA0  (via drill 0.08 pad 0.03)
  Bottom 0.076: U2.G7 15.3,11.2 16,11.2 16.2,11.4 17.3,11.4 19.7,13.8 21.7,13.8 23.4,15.5 23.4,19.9 23.2,20.1 23.2,22.6 23,22.8 23,28.6 25.7,31.3 25.7,40 25.9,40.2 25.9,45 J4.3
  other vias: 15.1,11.4
PA1  (via drill 0.08 pad 0.03)
  Bottom 0.076: U2.G6 14.9,11.6 15.8,11.6 16,11.8 17.1,11.8 19.5,14.2 21.5,14.2 23,15.7 23,19.7 22.8,19.9 22.8,22.4 22.6,22.6 22.6,27.4 22.4,27.6 22.4,32.4 22.2,32.6 22.2,37.5 19.58,40.12 19.58,42.42 18.31,43.69 J10.5
  other vias: 14.7,11.4
PA2  (via drill 0.08 pad 0.03)
  Bottom 0.076: U2.F6 14.9,12 15.6,12 15.8,12.2 16.9,12.2 19.3,14.6 21.3,14.6 22.6,15.9 22.6,19.5 22.4,19.7 22.4,22.2 22.2,22.4 22.2,27.2 19.58,29.82 19.58,32.32 18.31,33.59 J8.5
  other vias: 14.7,11.8
PA3
  Top 0.076: U2.J8 15.3,10.4 15.3,10.1 15.7,9.7 23,9.7 23.5,10.2 23.5,13.8 24.6,14.9 24.6,22 25.3,22.7 25.3,25 25.5,25.2 25.5,27.4 25.7,27.6 25.7,29.8 25.9,30 25.9,32.29 J2.2
PA4
  Top 0.076: U2.K10 16.4,10.1 22.8,10.1 23.1,10.4 23.1,14 24.2,15.1 24.2,23.1 23.8,23.5 23.8,28 23.4,28.4 23.4,28.7 25.3,30.6 25.3,32.7 25.5,32.9 25.5,35 25.7,35.2 25.7,37.2 25.9,37.4 25.9,42.45 J4.4
PA5
  Top 0.076: U2.K9 16.1,10.4 16.5,10.4 16.6,10.3 22.7,10.3 22.9,10.5 22.9,14.1 24,15.2 24,23 23.6,23.4 23.6,27.9 23.2,28.3 23.2,28.8 25.1,30.7 25.1,32.8 25.3,33 25.3,35.1 25.5,35.3 25.5,37.3 25.7,37.5 25.7,42.6 25.9,42.8 25.9,47.53 J4.2
PA6  (via drill 0.08 pad 0.03)
  Bottom 0.076: U2.H7 16.05,11 16.25,11.2 17.4,11.2 19.8,13.6 21.8,13.6 23.6,15.4 23.6,20 23.4,20.2 23.4,22.7 23.2,22.9 23.2,27.7 23.2,28.5 25.9,31.2 25.9,39.91 J4.5
  other vias: 15.1,11
PA7  (via drill 0.08 pad 0.03)
  Bottom 0.076: U2.H6 14.5,10.8 12.1,10.8 10.7,12.2 3.3,12.2 3.1,12.4 3.1,22.13 J1.6
  other vias: 14.7,11
PA8
  Top 0.076: U2.J7 14.9,10.4 14.9,9.9 15.5,9.3 23.2,9.3 23.9,10 23.9,13.6 25,14.7 25,21.8 25.7,22.5 25.7,24.8 25.9,25 25.9,27.21 J2.4
PA9
  Top 0.076: U2.K8 15.8,9.9 22.9,9.9 23.3,10.3 23.3,13.9 24.4,15 24.4,22.1 25.1,22.8 25.1,25.1 25.3,25.3 25.3,27.5 25.5,27.7 25.5,29.9 25.7,30.1 25.7,32.4 25.9,32.6 25.9,34.83 J2.1
PA10
  Top 0.076: U2.B5 14.5,13.6 14.5,18.6 13.9,19.2 12.1,19.2 11.9,19.4 9.7,19.4 8.21,20.89 J5.1
PA11
  Top 0.076: U2.A1 12.3,14.2 12.3,17.6 12.1,17.8 11.4,17.8 11.2,18 9,18 8.6,18.4 6.4,18.4 5.6,19.2 5.6,22.8 6,23.2 6,27.7 6.4,28.1 6.4,32.6 6.8,33 6.8,37.4 9.42,40.02 9.42,42.42 11.96,44.96 11.96,47.56 10.69,48.83 J11.2
PA12
  Top 0.076: U2.A2 12.5,14.4 12.5,17.8 12.3,18 11.5,18 11.3,18.2 9.1,18.2 8.7,18.6 6.5,18.6 5.8,19.3 5.8,22.7 6.2,23.1 6.2,27.6 6.6,28 6.6,32.5 8.15,34.05 J8.1
PA13
  Top 0.076: U2.A5 14.3,18.4 13.7,19 12,19 11.8,19.2 9.6,19.2 9.2,19.6 7,19.6 6.8,19.8 6.8,22.2 9.42,24.82 9.42,27.22 11.96,29.76 11.96,32.36 13.23,33.63 J8.3
PA14
  Top 0.076: U2.A3 13.5,17.6 12.9,18.2 11.6,18.2 11.4,18.4 9.2,18.4 8.8,18.8 6.6,18.8 6,19.4 6,22.6 6.4,23 6.4,27.5 6.8,27.9 6.8,32.4 9.42,35.02 9.42,37.42 11.96,39.96 11.96,42.46 13.23,43.73 J10.3
PA15
  Top 0.076: U2.A4 13.9,18 13.3,18.6 11.8,18.6 11.6,18.8 9.4,18.8 9,19.2 6.8,19.2 6.4,19.6 6.4,22.4 6.8,22.8 6.8,27.3 9.42,29.92 9.42,32.32 11.96,34.86 11.96,37.46 12,37.5 13.23,38.73 J9.3
PB2
  Top 0.076: U2.K7 15.1,10 15.6,9.5 23.1,9.5 23.7,10.1 23.7,13.7 24.8,14.8 24.8,21.9 25.5,22.6 25.5,24.9 25.7,25.1 25.7,27.3 25.9,27.5 25.9,29.75 J2.3
PB3
  Top 0.076: U2.A9 15.9,19.2 16.1,19.4 16.8,19.4 17,19.6 19.2,19.6 19.58,19.98 19.58,22.12 17.04,24.66 17.04,27.26 15.77,28.53 J7.4
PB4
  Top 0.076: U2.C7 15.3,13.2 15.6,13.2 15.7,13.3 15.7,13.48 15.82,13.6 16,13.6 16.1,13.7 16.1,19.1 16.2,19.2 16.9,19.2 17.1,19.4 19.3,19.4 20.79,20.89 J5.6
PB5  (via drill 0.08 pad 0.03)
  Bottom 0.076: U2.D6 14.5,12.8 14.5,14.1 14.9,14.5 14.9,18.9 14.4,19.4 12.2,19.4 10.71,20.89 J5.2
  other vias: 14.7,12.6
PB6  (via drill 0.08 pad 0.03)
  Bottom 0.076: U2.F5 14.5,11.6 14.5,11.2 14.3,11 12.2,11 10.8,12.4 3.5,12.4 3.3,12.6 3.3,22.3 3.1,22.5 3.1,24.67 J1.5
  other vias: 14.3,11.8
PB7  (via drill 0.08 pad 0.03)
  Bottom 0.076: U2.D7 15.1,13.8 15.5,14.2 15.5,19.1 16,19.6 16.7,19.6 17.04,19.94 17.04,47.56 J11.6
  other vias: 15.1,12.6
PB8  (via drill 0.08 pad 0.03)
  Bottom 0.076: U2.F7 15.7,11.8 15.9,12 17,12 19.4,14.4 21.4,14.4 22.8,15.8 22.8,19.6 22.6,19.8 22.6,22.3 22.4,22.5 22.4,27.3 22.2,27.5 22.2,32.3 19.58,34.92 19.58,37.42 18.31,38.69 J9.5
  other vias: 15.1,11.8
PB9
  Top 0.076: U2.F10 17.1,11.8 19.3,14 21.6,14 23.2,15.6 23.2,22.6 22.8,23 22.8,27.5 22.4,27.9 22.4,32.1 19.58,34.92 19.58,37.42 17.04,39.96 17.04,42.46 15.77,43.73 J10.4
PB10
  Top 0.076: U2.K6 14.7,9.8 15.4,9.1 23.3,9.1 24.1,9.9 24.1,13.5 25.2,14.6 25.2,21.7 25.9,22.4 25.9,24.67 J2.5
PB11
  Top 0.076: U2.J6 14.5,10.4 14.5,9.7 15.3,8.9 23.4,8.9 24.3,9.8 24.3,13.4 25.4,14.5 25.4,21.63 J2.6
PB12
  Top 0.076: U2.G3 13.3,11.6 13.3,12.3 13.2,12.4 13.02,12.4 12.9,12.52 12.9,12.7 12.8,12.8 12.2,12.8 10.7,14.3 10.7,17.1 10.6,17.2 8.6,17.2 8.2,17.6 6,17.6 3.1,20.5 3.1,42.45 J3.4
PB13
  Top 0.076: U2.C1 12.3,13 10.9,14.4 10.9,17.3 10.8,17.4 8.7,17.4 8.3,17.8 6.1,17.8 3.3,20.6 3.3,42.6 3.1,42.8 3.1,47.53 J3.2
PB14
  Top 0.076: U2.E2 13,12.2 12.8,12.4 12,12.4 10.7,13.7 3.7,13.7 3.5,13.9 3.5,14.7 3.3,14.9 3.3,17.2 3.1,17.4 3.1,19.59 J1.7
PB15  (via drill 0.08 pad 0.03)
  Bottom 0.076: U2.F3 13.1,11.8 12.8,12.1 12.3,12.1 11.2,13.2 5.9,13.2 5.3,13.8 4.3,13.8 4.1,14 4.1,22.7 3.9,22.9 3.9,25.1 3.7,25.3 3.7,27.5 3.5,27.7 3.5,30 3.3,30.2 3.3,32.4 3.1,32.6 3.1,34.83 J1.1
  other vias: 13.5,11.8
PC0
  Top 0.076: U2.F8 15.7,11.6 15.7,11.3 15.8,11.2 17.4,11.2 19.6,13.4 21.9,13.4 23.8,15.3 23.8,22.9 23.4,23.3 23.4,27.8 23,28.2 23,32.4 22.4,33 22.4,37.6 22.2,37.8 22.2,42.5 20.85,43.85 J10.6
PC1  (via drill 0.08 pad 0.03)
  Bottom 0.076: U2.G8 15.9,11.4 16.1,11.6 17.2,11.6 19.6,14 21.6,14 23.2,15.6 23.2,19.8 23,20 23,22.5 22.8,22.7 22.8,27.5 22.6,27.7 22.6,32.5 22.4,32.7 22.4,37.6 20.85,39.15 J9.6
  other vias: 15.5,11.4
PC2
  Top 0.076: U2.G9 16.1,11.6 17.2,11.6 19.4,13.8 21.7,13.8 23.4,15.5 23.4,22.7 23,23.1 23,27.6 22.6,28 22.6,32.2 20.85,33.95 J8.6
PC3
  Top 0.076: U2.G10 17.3,11.4 19.5,13.6 21.8,13.6 23.6,15.4 23.6,22.8 23.2,23.2 23.2,27.7 22.8,28.1 22.8,32.3 22.2,32.9 22.2,37.5 19.58,40.12 19.58,42.42 17.04,44.96 17.04,47.56 18.31,48.83 J11.5
PC4  (via drill 0.08 pad 0.03)
  Bottom 0.076: U2.G4 12.4,11.4 11,12.8 3.9,12.8 3.7,13 3.7,22.5 3.5,22.7 3.5,24.9 3.3,25.1 3.3,27.3 3.1,27.5 3.1,29.75 J1.3
  other vias: 13.9,11.4
PC5
  Top 0.076: U2.H5 14.1,10.8 13.02,10.8 12.9,10.92 12.9,11.1 12.8,11.2 12.4,11.2 12.2,11.4 11.5,11.4 10.7,12.2 2.87,12.2 J1.10
PC6
  Top 0.076: U2.D2 13.1,12.72 12.9,12.92 12.9,13.05 12.75,13.2 12.4,13.2 11.1,14.5 11.1,17.5 11,17.6 8.8,17.6 8.4,18 6.2,18 5.2,19 5.2,23 5.6,23.4 5.6,27.9 6,28.3 6,32.8 6.4,33.2 6.4,37.6 6.8,38 6.8,42.4 8.15,43.75 J10.1
PC7  (via drill 0.08 pad 0.03)
  Bottom 0.076: U2.E3 13.3,12.2 12.6,12.9 12.6,14.9 13.5,15.8 13.5,17.6 13.1,18 11.5,18 11.1,18.4 9.2,18.4 9,18.6 4.7,18.6 4.5,18.8 4.5,22.9 4.3,23.1 4.3,25.3 4.1,25.5 4.1,27.7 3.9,27.9 3.9,30.2 3.7,30.4 3.7,32.6 3.5,32.8 3.5,35 3.3,35.2 3.3,40 3.1,40.2 3.1,44.99 J3.3
  other vias: 13.5,12.2
PC8  (via drill 0.08 pad 0.03)
  Bottom 0.076: U2.F4 13.7,11.6 12.5,11.6 11.1,13 5.8,13 5.2,13.6 4.1,13.6 3.9,13.8 3.9,22.6 3.7,22.8 3.7,25 3.5,25.2 3.5,27.4 3.3,27.6 3.3,29.9 3.1,30.1 3.1,32.29 J1.2
  other vias: 13.9,11.8
PC9
  Top 0.076: U2.B4 14.1,13.6 14.1,18.2 13.5,18.8 11.9,18.8 11.7,19 9.5,19 9.1,19.4 6.9,19.4 6.6,19.7 6.6,22.3 8.15,23.85 J6.1
PC10
  Top 0.076: U2.A6 14.7,18.8 14.1,19.4 12.2,19.4 12,19.6 9.8,19.6 9.42,19.98 9.42,22.12 11.96,24.66 11.96,27.26 13.23,28.53 J7.3
PC11
  Top 0.076: U2.B6 14.9,13.6 14.9,18.9 14.2,19.6 12.3,19.6 11.96,19.94 11.96,22.16 13.23,23.43 J6.3
PC12  (via drill 0.08 pad 0.03)
  Bottom 0.076: U2.C5 14.3,14.2 14.7,14.6 14.7,18.8 14.3,19.2 12.1,19.2 11.7,19.6 9.8,19.6 9.42,19.98 9.42,22.12 10.69,23.39 J6.2
  other vias: 14.3,13
PC13  (via drill 0.08 pad 0.03)
  Bottom 0.076: U2.G5 14.1,11.2 12.3,11.2 10.9,12.6 3.7,12.6 3.5,12.8 3.5,22.4 3.3,22.6 3.3,24.8 3.1,25 3.1,27.21 J1.4
  other vias: 14.3,11.4
PD0  (via drill 0.08 pad 0.03)
  Bottom 0.076: U2.C4 13.9,14.4 14.3,14.8 14.3,18.4 13.9,18.8 11.9,18.8 11.5,19.2 9.6,19.2 9.4,19.4 6.9,19.4 6.6,19.7 6.6,22.3 6.8,22.5 6.8,27.3 9.42,29.92 9.42,32.32 10.69,33.59 J8.2
  other vias: 13.9,13
PD1
  Top 0.076: U2.C3 13.7,13.2 13.7,17.8 13.1,18.4 11.7,18.4 11.5,18.6 9.3,18.6 8.9,19 6.7,19 6.2,19.5 6.2,22.5 6.6,22.9 6.6,27.4 8.15,28.95 J7.1
PD2
  Top 0.076: U2.A7 15.1,19 13.23,20.87 J5.3
PD3
  Top 0.076: U2.C2 13.1,13.1 12.9,13.3 12.9,13.5 12.8,13.6 12.6,13.6 12.1,14.1 12.1,17.4 11.9,17.6 11.3,17.6 11.1,17.8 8.9,17.8 8.5,18.2 6.3,18.2 5.4,19.1 5.4,22.9 5.8,23.3 5.8,27.8 6.2,28.2 6.2,32.7 6.6,33.1 6.6,37.5 8.15,39.05 J9.1
PD4  (via drill 0.08 pad 0.03)
  Bottom 0.076: U2.D3 13.5,14.6 13.9,15 13.9,18 13.5,18.4 11.7,18.4 11.3,18.8 9.4,18.8 9.2,19 6.7,19 6.2,19.5 6.2,22.5 6.4,22.7 6.4,27.5 6.6,27.7 6.6,32.5 6.8,32.7 6.8,37.4 9.42,40.02 9.42,42.42 10.69,43.69 J10.2
  other vias: 13.5,12.6
PD5
  Top 0.076: U2.B7 15.3,13.6 15.3,19.1 14.5,19.9 14.5,47.6 13.23,48.87 J11.3
PD6  (via drill 0.08 pad 0.03)
  Bottom 0.076: U2.C6 14.7,14 15.1,14.4 15.1,19 14.5,19.6 12.3,19.6 11.96,19.94 11.96,47.56 J11.1
  other vias: 14.7,13
PD7
  Top 0.076: J5.4 15.5,20.62 U2.A8
PD8  (via drill 0.08 pad 0.03)
  Bottom 0.076: U2.D4 13.7,12.8 13.7,14.5 14.1,14.9 14.1,18.2 13.7,18.6 11.8,18.6 11.4,19 9.5,19 9.3,19.2 6.8,19.2 6.4,19.6 6.4,22.4 6.6,22.6 6.6,27.4 6.8,27.6 6.8,32.4 9.42,35.02 9.42,37.42 10.69,38.69 J9.2
  other vias: 13.9,12.6
PD9  (via drill 0.08 pad 0.03)
  Bottom 0.076: U2.D5 14.1,12.8 14.1,14.3 14.5,14.7 14.5,18.6 14.1,19 12,19 11.6,19.4 9.7,19.4 9.5,19.6 7,19.6 6.8,19.8 6.8,22.2 9.42,24.82 9.42,27.22 10.69,28.49 J7.2
  other vias: 14.3,12.6
PD10  (via drill 0.08 pad 0.03)
  Bottom 0.076: U2.E4 13.7,12 13.2,12 12.4,12.8 12.4,15 13.3,15.9 13.3,17.5 13,17.8 11.4,17.8 11,18.2 9.1,18.2 8.9,18.4 4.5,18.4 4.3,18.6 4.3,22.8 4.1,23 4.1,25.2 3.9,25.4 3.9,27.6 3.7,27.8 3.7,30.1 3.5,30.3 3.5,32.5 3.3,32.7 3.3,34.9 3.1,35.1 3.1,39.91 J3.5
  other vias: 13.9,12.2
PD11  (via drill 0.08 pad 0.03)
  Bottom 0.076: U2.E5 14.1,12.4 13.4,12.4 13.3,12.5 13.3,14.7 13.7,15.1 13.7,17.8 13.3,18.2 11.6,18.2 11.2,18.6 9.3,18.6 9.1,18.8 4.9,18.8 4.7,19 4.7,23 4.5,23.2 4.5,25.4 4.3,25.6 4.3,27.8 4.1,28 4.1,30.3 3.9,30.5 3.9,32.7 3.7,32.9 3.7,35.1 3.5,35.3 3.5,40.1 3.3,40.3 3.3,45.1 3.1,45.3 3.1,50.07 J3.1
  other vias: 14.3,12.2
PD12
  Top 0.076: U2.B8 15.5,13.5 15.7,13.7 15.7,19.3 16,19.6 16.7,19.6 17.04,19.94 17.04,22.16 15.77,23.43 J6.4
PD13
  Top 0.076: U2.C9 16.1,13.2 16.4,13.2 17.3,14.1 17.3,18.9 17.4,19 19.5,19 19.9,19.4 22.1,19.4 22.4,19.7 22.4,22.2 20.85,23.75 J6.6
PD14  (via drill 0.08 pad 0.03)
  Bottom 0.076: U2.D8 15.7,12.8 15.7,13.5 16.1,13.9 16.1,18.7 16.4,19 17,19 17.4,19.4 19.3,19.4 19.5,19.6 22,19.6 22.2,19.8 22.2,22.1 19.58,24.72 19.58,27.22 18.31,28.49 J7.5
  other vias: 15.5,12.6
PD15  (via drill 0.08 pad 0.03)
  Bottom 0.076: U2.E7 15.3,12.4 15.3,13.7 15.7,14.1 15.7,19 16.1,19.4 16.8,19.4 18.29,20.89 J5.5
  other vias: 15.1,12.2
PE0  (via drill 0.08 pad 0.03)
  Bottom 0.076: U2.C8 15.5,13.6 15.9,14 15.9,18.9 16.2,19.2 16.9,19.2 17.3,19.6 19.2,19.6 19.58,19.98 19.58,22.12 18.31,23.39 J6.5
  other vias: 15.5,13
PE1
  Top 0.076: U2.B10 17.1,14.2 17.1,19.1 17.2,19.2 19.4,19.2 19.8,19.6 22,19.6 22.2,19.8 22.2,22.1 19.58,24.72 19.58,27.22 17.04,29.76 17.04,32.36 15.77,33.63 J8.4
PE2  (via drill 0.08 pad 0.03)
  Bottom 0.076: U2.E6 14.9,12.4 14.9,13.9 15.3,14.3 15.3,19.1 14.5,19.9 14.5,47.6 15.77,48.87 J11.4
  other vias: 14.7,12.2
PE3
  Top 0.076: U2.G2 12.9,11.6 12.6,11.6 12.4,11.8 11.7,11.8 10.9,12.6 3.5,12.6 3.3,12.8 3.3,14.6 3.12,14.78 3.12,17.02 J1.8
PE4
  Top 0.076: U2.G1 12.5,11.4 12.3,11.6 11.6,11.6 10.8,12.4 5,12.4 4.9,12.4 3.3,12.4 3.1,12.6 3.1,14.51 J1.9
PH0
  Top 0.076: U2.E10 16.9,12.2 19.1,14.4 21.4,14.4 22.8,15.8 22.8,22.4 22.4,22.8 22.4,27.3 20.85,28.85 J7.6
PH1
  Top 0.076: U2.E9 16.1,12.4 16.8,12.4 19,14.6 21.3,14.6 22.6,15.9 22.6,22.3 22.2,22.7 22.2,27.2 19.58,29.82 19.58,32.32 17.04,34.86 17.04,37.46 15.77,38.73 J9.4
RF
  pour Top (no thermals): 13.65,10.1 13.85,10.3 13.95,10.3 14.15,10.1 14.15,5.38 13.65,5.38
VBAT  (via drill 0.15 pad 0.25)
  Top 0.152: U2.C10 16.5,13 17.85,14.35 v17.85,14.6 C32.1
  Route15 0.254: J2.9 25.99,14.6 v17.85,14.6
VCC  (via drill 0.08 pad 0.25, 0.15 pad 0.25)
  Top 0.076: U2.J3 13.3,10.4 12.4,10.4 | U2.B3 13.3,13.6 13.3,14
  Top 0.152: U2.H8 U2.H9 U2.J10 19.4,10.6 | U2.B1 12.5,13.4 11.6,14.3 v11.6,14.65 C20.1 | C26.1 10.3,15.65 10.5,15.45 | U2.D1 12.1,12.6 10.5,14.2 | C31.1 10.3,14.4 10.5,14.2 | 10.5,14.2 10.5,15.45 | 13.3,14 13,14.3 v13,14.65 C21.1 | U2.A10 16.6,14.1 v16.6,14.65 C18.1 | 19.4,10.6 20.65,10.6 | 20.65,10.6 21.9,10.6 | 21.9,10.6 22.2,10.9 C22.1 | C24.1 20.95,10.9 20.65,10.6 | C23.1 19.7,10.9 19.4,10.6 | v22.5,10.6 21.9,10.6 | U2.K5 14.3,9.55 v15.4,8.45 C19.1 | C29.1 v11.8,8.9 12.15,9.25 12.15,10.15 | 12.15,10.15 12.4,10.4 | 12.15,10.15 C30.1 | v10.4,16.45 10.5,16.35 10.5,15.45 | LED1.A 25.35,12.55 26.07,13.27 J2.10
  pour Route15 (rank 6): 0,8 29,8 29,56.3 0,56.3

### Text on the board
tPlace: PD6 | PA11 | PD5 | PE2 | PC3 | PB7 | PD11 | !RESET! | PB13 | PA5 | PC6 | PD4 | PA14 | PB9 | PA1 | PC0 | PC7 | PA0 | PB12 | PA4 | PD3 | PD8 | PA15 | PH1 | PB8 | PC1 | PD10 | PA6 | PA12 | PD0 | PA13 | PE1 | PA2 | PC2 | PB15 | PA9 | PC8 | PA3 | PD1 | PD9 | PC10 | PB3 | PD14 | PH0 | PC4 | PB2 | PC13 | PA8 | PC9 | PC12 | PC11 | PD12 | PE0 | PD13 | PB6 | PB10 | PA7 | PB11 | PA10 | PB5 | PD2 | PD7 | PD15 | PB4 | PB14 | GND | PE3 | GND | PE4 | VBAT | PC5 | VCC | STM32WB55VGY6-breakout | Rev 1